# Altium project DiyOpenTx.PrjPcb
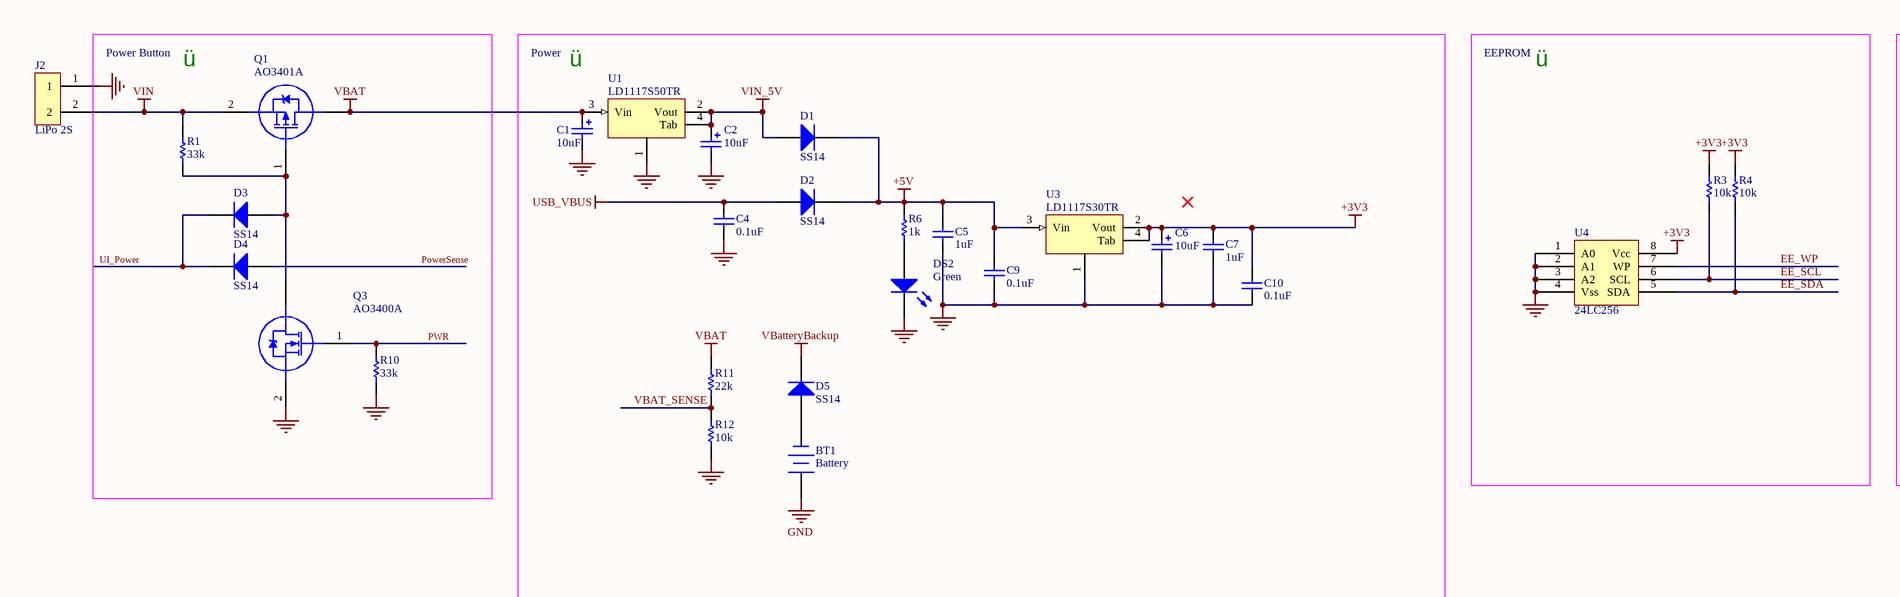
[diagram p0: DiyOpenTx.SchDoc, top left]
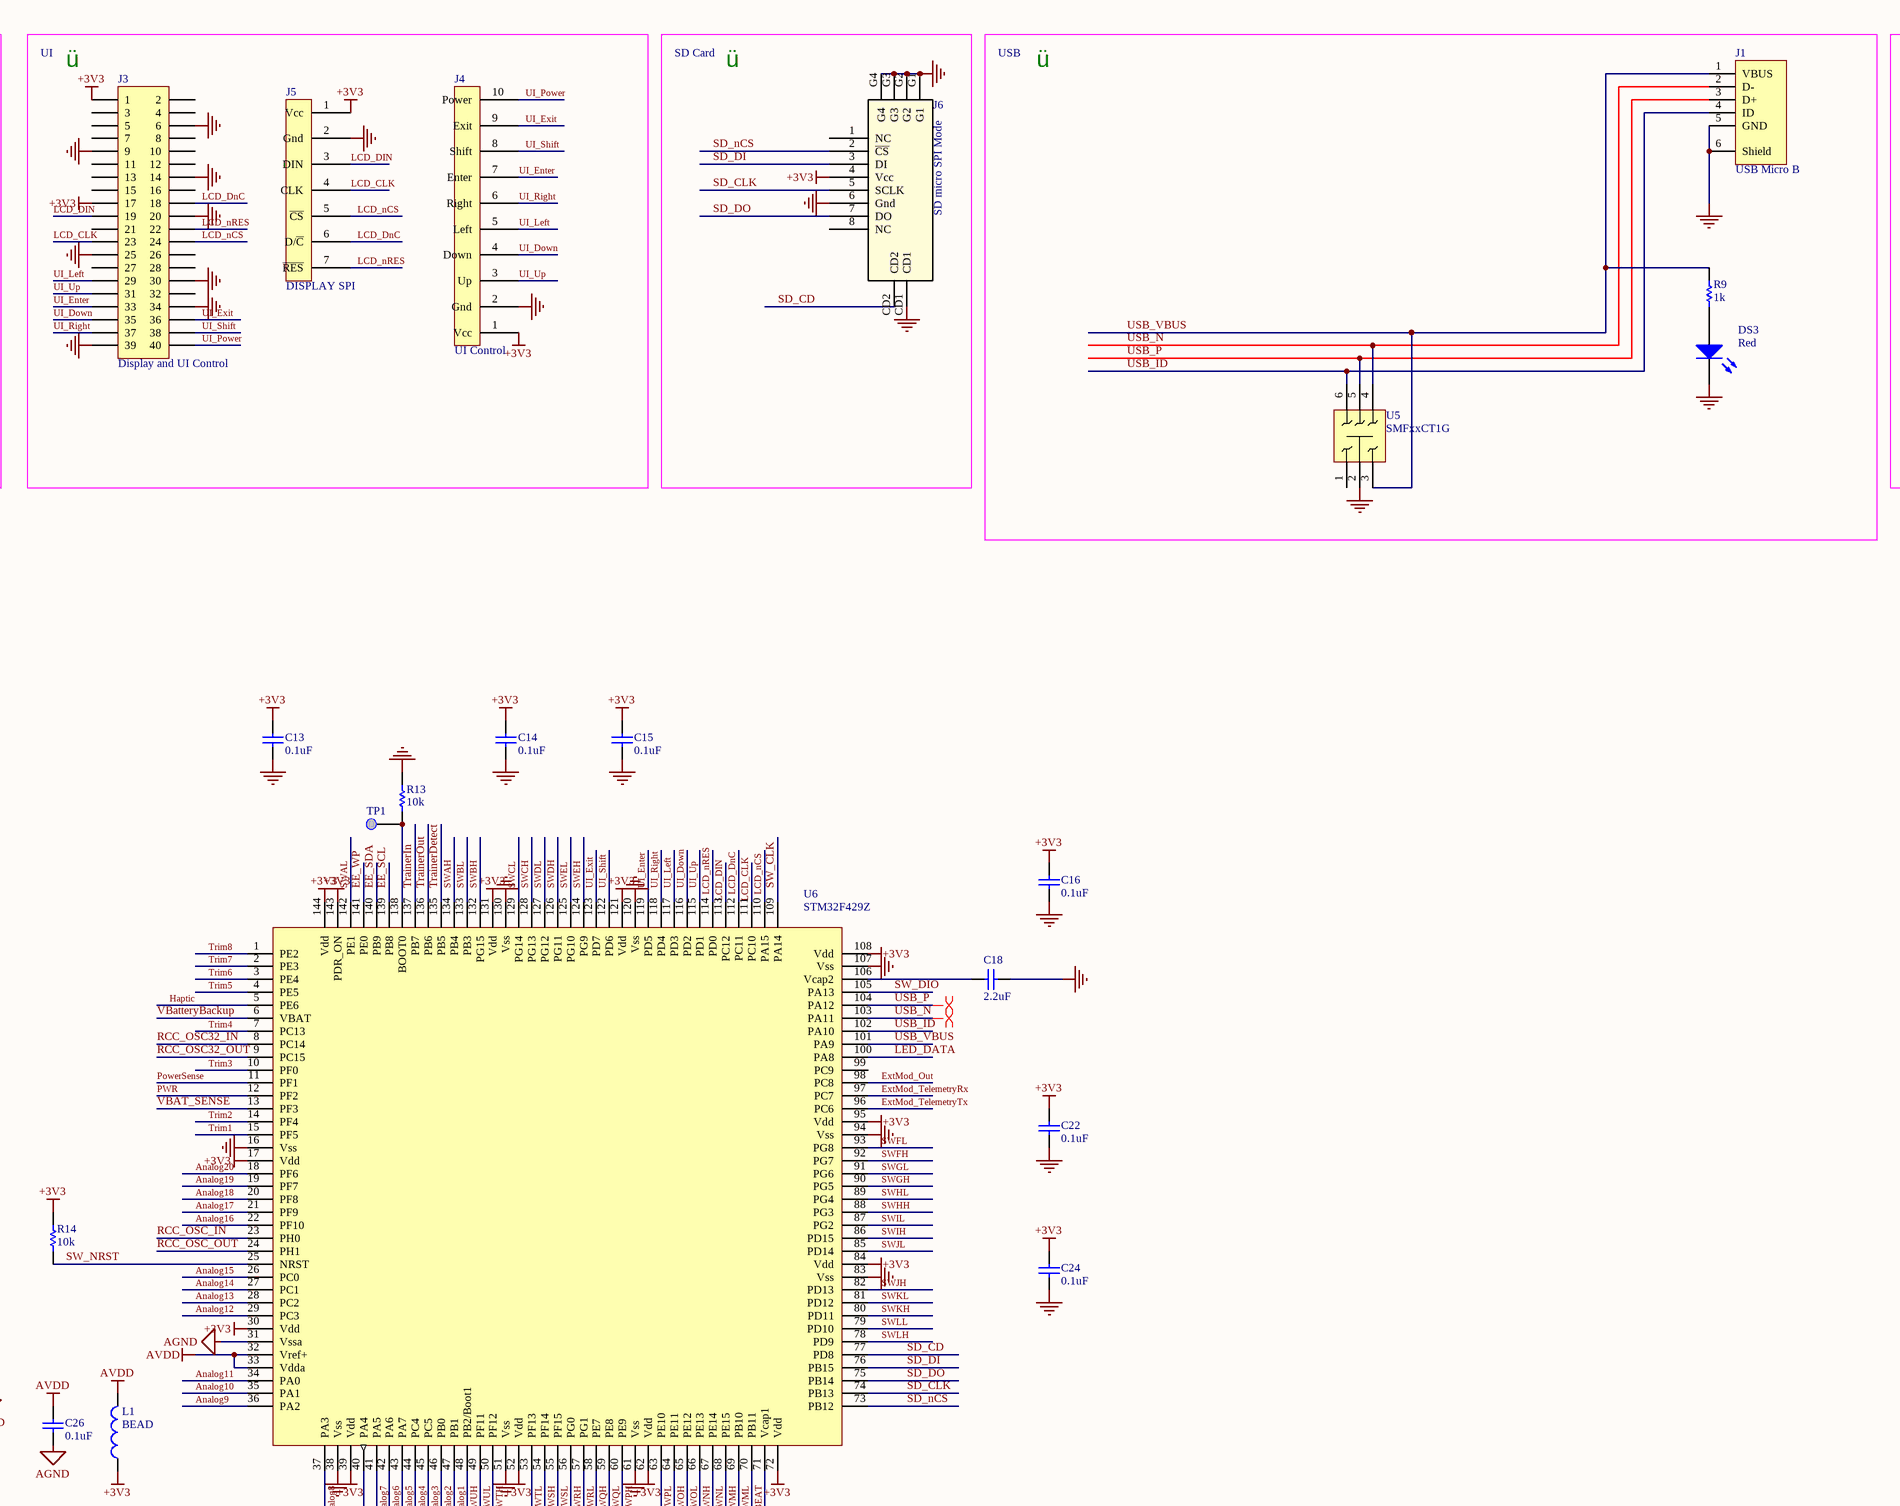
[diagram p1: DiyOpenTx.SchDoc, top middle]
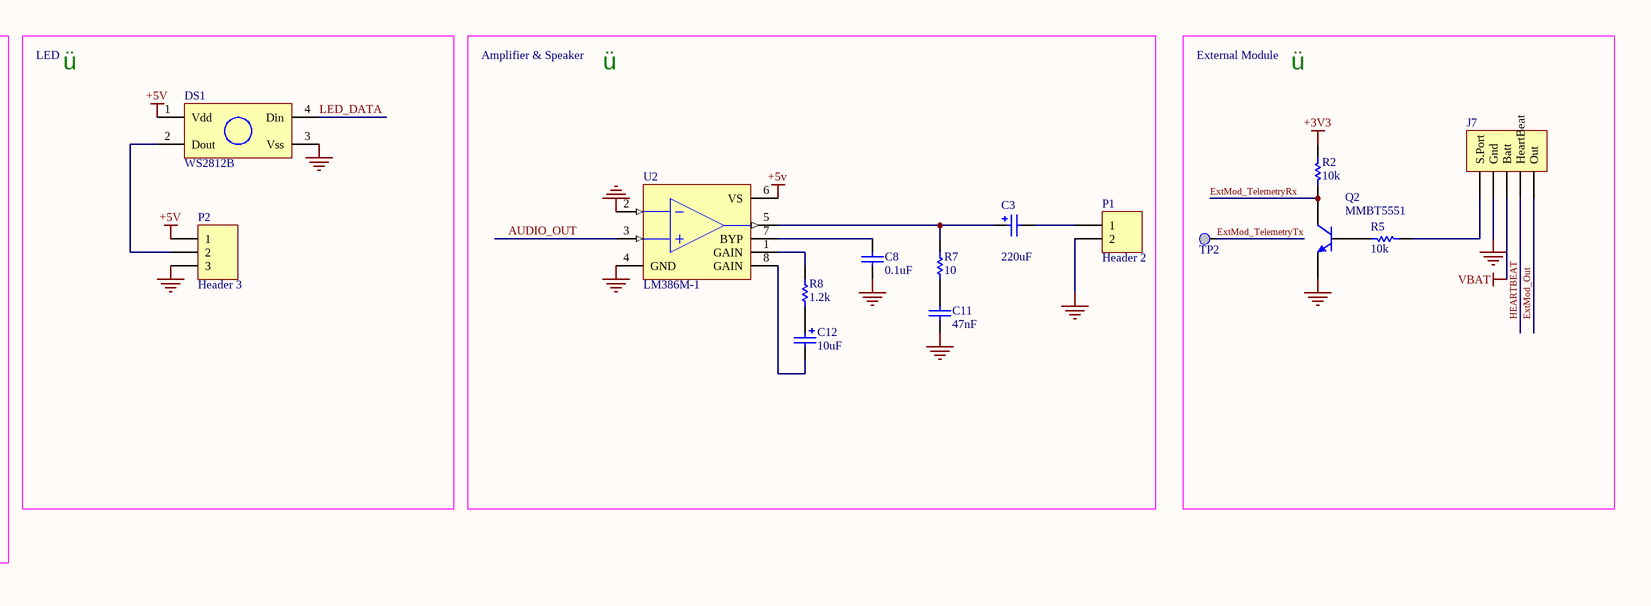
[diagram p2: DiyOpenTx.SchDoc, top right]
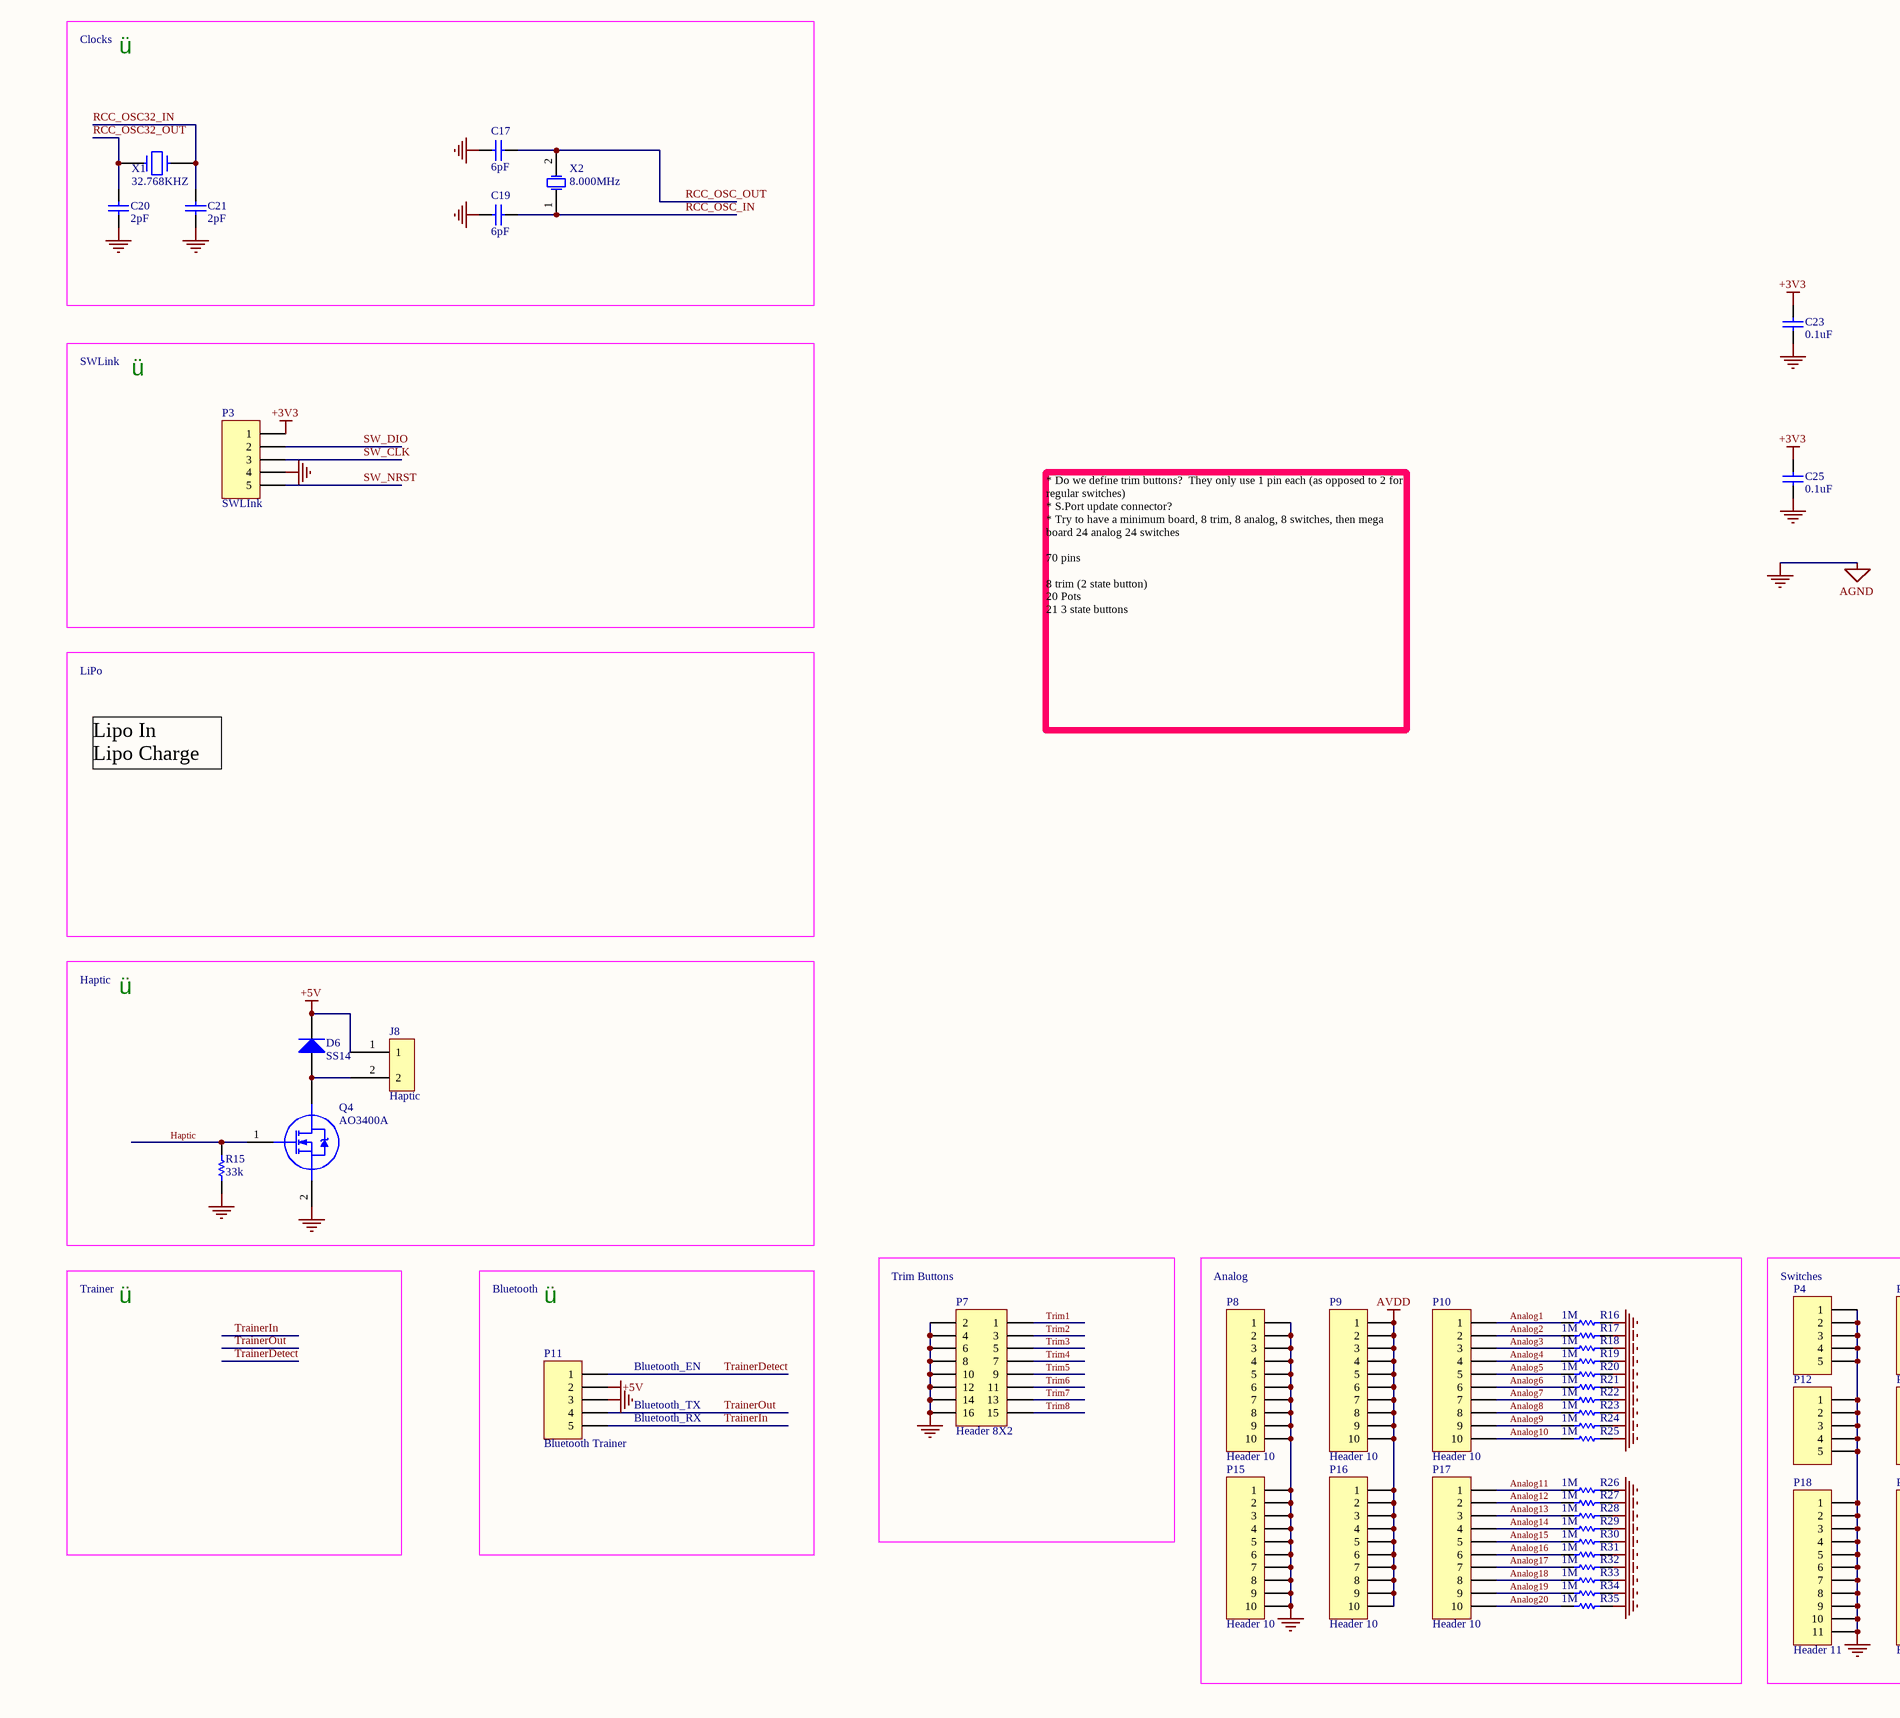
[diagram p3: DiyOpenTx.SchDoc, bottom left]
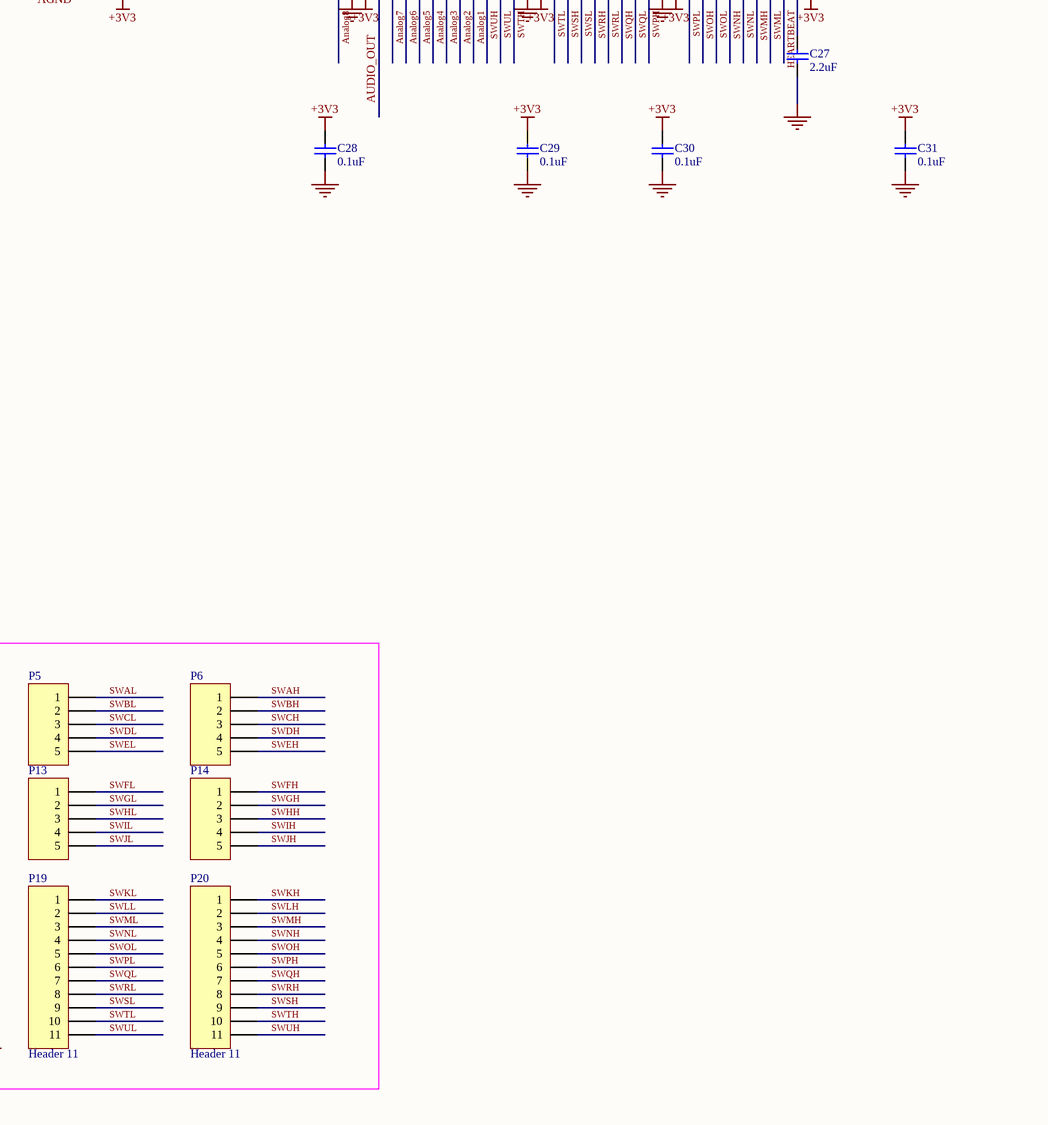
[diagram p4: DiyOpenTx.SchDoc, bottom middle]
1 sheet, 119 parts. Net scope: global (net labels, ports and power ports of the same name join across sheets).

## Sheet DiyOpenTx.SchDoc
size A0

### Parts
BT1  Battery  [Button Cell Holder 20mm SMD]
C1  10uF  [Cap SMD 1206]
C2  10uF  [Cap SMD 1206]
C3  value 220uF  [Cap SMD Elect 8x10]  (hidden comment: Cap Pol)
C4  value 0.1uF  [Cap SMD 0805A]  (hidden comment: Cap)
C5  value 1uF  [Cap SMD 0805A]  (hidden comment: Cap)
C6  10uF  [Cap SMD 1206]
C7  value 1uF  [Cap SMD 0805A]  (hidden comment: Cap)
C8  value 0.1uF  [Cap SMD 0805A]  (hidden comment: Cap)
C9  value 0.1uF  [Cap SMD 0805A]  (hidden comment: Cap)
C10  value 0.1uF  [Cap SMD 0805A]  (hidden comment: Cap)
C11  value 47nF  [Cap SMD 0805A]  (hidden comment: Cap)
C12  value 10uF  [Cap SMD 1206]  (hidden comment: Cap Pol)
C13  value 0.1uF  [Cap SMD 0805A]  (hidden comment: Cap)
C14  value 0.1uF  [Cap SMD 0805A]  (hidden comment: Cap)
C15  value 0.1uF  [Cap SMD 0805A]  (hidden comment: Cap)
C16  value 0.1uF  [Cap SMD 0805A]  (hidden comment: Cap)
C17  value 6pF  [Cap SMD 0805A]  (hidden comment: Cap)
C18  value 2.2uF  [Cap SMD 0805A]  (hidden comment: Cap)
C19  value 6pF  [Cap SMD 0805A]  (hidden comment: Cap)
C20  value 2pF  [Cap SMD 0805A]  (hidden comment: Cap)
C21  value 2pF  [Cap SMD 0805A]  (hidden comment: Cap)
C22  value 0.1uF  [Cap SMD 0805A]  (hidden comment: Cap)
C23  value 0.1uF  [Cap SMD 0805A]  (hidden comment: Cap)
C24  value 0.1uF  [Cap SMD 0805A]  (hidden comment: Cap)
C25  value 0.1uF  [Cap SMD 0805A]  (hidden comment: Cap)
C26  value 0.1uF  [Cap SMD 0805A]  (hidden comment: Cap)
C27  value 2.2uF  [Cap SMD 0805A]  (hidden comment: Cap)
C28  value 0.1uF  [Cap SMD 0805A]  (hidden comment: Cap)
C29  value 0.1uF  [Cap SMD 0805A]  (hidden comment: Cap)
C30  value 0.1uF  [Cap SMD 0805A]  (hidden comment: Cap)
C31  value 0.1uF  [Cap SMD 0805A]  (hidden comment: Cap)
D1  SS14  [DO-214AC]
D2  SS14  [DO-214AC]
D3  SS14  [DO-214AC]
D4  SS14  [DO-214AC]
D5  SS14  [DO-214AC]
D6  SS14  [DO-214AC]
DS1  WS2812B  [WS2812B 5050]
DS2  Green  [LED SMD 0805]
DS3  Red  [LED SMD 0805]
J1  USB Micro B  [USB Micro B - Molex 548190519]
J2  LiPo 2S  [0.1 SIP 2 PIN]
J3  Display and UI Control  [HDR20x2 Shrouded]
J4  UI Control  [0.1 SIP 10 PIN]
J5  DISPLAY SPI  [0.1 SIP 8 PIN]
J6  SD micro SPI Mode  [SD Card Moles 1040310811]
J7  Header 5  [HDR1X5]  (value not drawn)
J8  Haptic  [0.1 SIP 2 PIN]
L1  BEAD  [INDC1608L]
P1  Header 2  [HDR1X2]
P2  Header 3  [HDR1X3]
P3  SWLInk  [HDR1X5]
P4  Header 5  [HDR1X5]  (value not drawn)
P5  Header 5  [HDR1X5]  (value not drawn)
P6  Header 5  [HDR1X5]  (value not drawn)
P7  Header 8X2  [HDR2X8]
P8  Header 10  [HDR1X10]
P9  Header 10  [HDR1X10]
P10  Header 10  [HDR1X10]
P11  Bluetooth Trainer  [HDR1X5]
P12  Header 5  [HDR1X5]  (value not drawn)
P13  Header 5  [HDR1X5]  (value not drawn)
P14  Header 5  [HDR1X5]  (value not drawn)
P15  Header 10  [HDR1X10]
P16  Header 10  [HDR1X10]
P17  Header 10  [HDR1X10]
P18  Header 11  [HDR1X11]
P19  Header 11  [HDR1X11]
P20  Header 11  [HDR1X11]
Q1  AO3401A  [SO-G3]
Q2  MMBT5551  [SO-G3]
Q3  AO3400A  [SO-G3]
Q4  AO3400A  [SO-G3]
R1  value 33k  [Res SMD 0805A]  (hidden comment: Res1)
R2  value 10k  [Res SMD 0805A]  (hidden comment: Res1)
R3  value 10k  [Res SMD 0805A]  (hidden comment: Res1)
R4  value 10k  [Res SMD 0805A]  (hidden comment: Res1)
R5  value 10k  [Res SMD 0805A]  (hidden comment: Res1)
R6  value 1k  [Res SMD 0805A]  (hidden comment: Res1)
R7  value 10  [Res SMD 0805A]  (hidden comment: Res1)
R8  value 1.2k  [Res SMD 0805A]  (hidden comment: Res1)
R9  value 1k  [Res SMD 0805A]  (hidden comment: Res1)
R10  value 33k  [Res SMD 0805A]  (hidden comment: Res1)
R11  value 22k  [Res SMD 0805A]  (hidden comment: Res1)
R12  value 10k  [Res SMD 0805A]  (hidden comment: Res1)
R13  value 10k  [Res SMD 0805A]  (hidden comment: Res1)
R14  value 10k  [Res SMD 0805A]  (hidden comment: Res1)
R15  value 33k  [Res SMD 0805A]  (hidden comment: Res1)
R16  value 1M  [Res SMD 0805A]  (hidden comment: Res1)
R17  value 1M  [Res SMD 0805A]  (hidden comment: Res1)
R18  value 1M  [Res SMD 0805A]  (hidden comment: Res1)
R19  value 1M  [Res SMD 0805A]  (hidden comment: Res1)
R20  value 1M  [Res SMD 0805A]  (hidden comment: Res1)
R21  value 1M  [Res SMD 0805A]  (hidden comment: Res1)
R22  value 1M  [Res SMD 0805A]  (hidden comment: Res1)
R23  value 1M  [Res SMD 0805A]  (hidden comment: Res1)
R24  value 1M  [Res SMD 0805A]  (hidden comment: Res1)
R25  value 1M  [Res SMD 0805A]  (hidden comment: Res1)
R26  value 1M  [Res SMD 0805A]  (hidden comment: Res1)
R27  value 1M  [Res SMD 0805A]  (hidden comment: Res1)
R28  value 1M  [Res SMD 0805A]  (hidden comment: Res1)
R29  value 1M  [Res SMD 0805A]  (hidden comment: Res1)
R30  value 1M  [Res SMD 0805A]  (hidden comment: Res1)
R31  value 1M  [Res SMD 0805A]  (hidden comment: Res1)
R32  value 1M  [Res SMD 0805A]  (hidden comment: Res1)
R33  value 1M  [Res SMD 0805A]  (hidden comment: Res1)
R34  value 1M  [Res SMD 0805A]  (hidden comment: Res1)
R35  value 1M  [Res SMD 0805A]  (hidden comment: Res1)
TP1  Test Point  [TestPoint through hole small]  (value not drawn)
TP2  Test Point  [TestPoint through hole small]  (value not drawn)
U1  LD1117S50TR  [SOT-223]
U2  LM386M-1  [M08A_N]
U3  LD1117S30TR  [SOT-223]
U4  24LC256  [SOIC8]
U5  SMFxxCT1G  [SOT-363]
U6  STM32F429Z  [LQFP144]
X1  32.768KHZ  [Crystal SMD-3215_2P]
X2  8.000MHz  [Crystal SMD-5032_2P]

### Blocks framed on the sheet
ü: D3 D4 Q1 Q3 R1 R10
ü: BT1 C1 C2 C4-C7 C9 C10 D1 D2 D5 DS2 R6 R11 R12 U1 U3
ü: R3 R4 U4
ü: J3-J5
ü: J6
ü: DS3 J1 R9 U5
ü: DS1 P2
ü: C3 C8 C11 C12 P1 R7 R8 U2
ü: J7 Q2 R2 R5 TP2
ü: C17 C19-C21 X1 X2
ü: P3
ü: D6 J8 Q4 R15
ü: P11
Trim Buttons: P7
Analog: P8-P10 P15-P17 R16-R35
Switches: P4-P6 P12-P14 P18-P20

### Nets
+3V3: C6.1 C7.2 C10.2 C13.2 C14.2 C15.2 C16.2 C22.2 C23.2 C24.2 C25.2 C28.2 C29.2 C30.2 C31.2 J3.1 J3.17 J4.1(Vcc) J5.1(Vcc) J6.4(Vcc) L1.1 P3.1 R2.1 R3.1 R4.1 R14.2 U3.2(Vout) U3.4(Tab) U4.8(Vcc) U6.17(Vdd) U6.30(Vdd) U6.39(Vdd) U6.52(Vdd) U6.62(Vdd) U6.72(Vdd) U6.84(Vdd) U6.95(Vdd) U6.108(Vdd) U6.121(Vdd) U6.131(Vdd) U6.143(PDR_ON) U6.144(Vdd)
+5V: C5.2 C9.2 D1.2(K) D2.2(K) D6.2(K) DS1.1(Vdd) J8.1 P2.1 P11.2 R6.2 U2.6(VS) U3.3(Vin)
AGND: BT1.1(+) C1.2 C2.2 C4.1 C5.1 C6.2 C7.1 C8.2 C9.1 C10.1 C11.2 C13.1 C14.1 C15.1 C16.1 C17.1 C18.2 C19.1 C20.2 C21.2 C22.1 C23.1 C24.1 C25.1 C26.1 C27.1 C28.1 C29.1 C30.1 C31.1 DS1.3(Vss) DS2.K DS3.K J1.5(GND) J1.6(Shield) J2.1 J3.6 J3.9 J3.14 J3.20 J3.25 J3.30 J3.34 J3.39 J4.2(Gnd) J5.2(Gnd) J6.6(Gnd) J6.CD1 J6.G1 J6.G2 J6.G3 J6.G4 J7.4(Gnd) P1.2 P2.3 P3.4 P4.1 P4.2 P4.3 P4.4 P4.5 P7.2 P7.4 P7.6 P7.8 P7.10 P7.12 P7.14 P7.16 P8.1 P8.2 P8.3 P8.4 P8.5 P8.6 P8.7 P8.8 P8.9 P8.10 P11.3 P12.1 P12.2 P12.3 P12.4 P12.5 P15.1 P15.2 P15.3 P15.4 P15.5 P15.6 P15.7 P15.8 P15.9 P15.10 P18.1 P18.2 P18.3 P18.4 P18.5 P18.6 P18.7 P18.8 P18.9 P18.10 P18.11 Q2.E Q3.2(S) Q4.2(S) R10.2 R12.2 R13.2 R15.2 R16.1 R17.1 R18.1 R19.1 R20.1 R21.1 R22.1 R23.1 R24.1 R25.1 R26.1 R27.1 R28.1 R29.1 R30.1 R31.1 R32.1 R33.1 R34.1 R35.1 U1.1 U2.2(IN-) U2.4(GND) U3.1 U4.1(A0) U4.2(A1) U4.3(A2) U4.4(Vss) U5.2 U6.16(Vss) U6.31(Vssa) U6.38(Vss) U6.51(Vss) U6.61(Vss) U6.83(Vss) U6.94(Vss) U6.107(Vss) U6.120(Vss) U6.130(Vss)  [also labelled GND]
AVDD: C26.2 L1.2 P9.1 P9.2 P9.3 P9.4 P9.5 P9.6 P9.7 P9.8 P9.9 P9.10 P16.1 P16.2 P16.3 P16.4 P16.5 P16.6 P16.7 P16.8 P16.9 P16.10 U6.32(Vref+) U6.33(Vdda)
USB_VBUS: C4.2 D2.1(A) J1.1(VBUS) R9.1 U5.3 U6.101(PA9)
VBAT: C1.1 J7.3(Batt) Q1.3(D) R11.1 U1.3(Vin)
VBatteryBackup: D5.2(K) U6.6(VBAT)
VIN: J2.2 Q1.2(S) R1.1
VIN_5V: C2.1 D1.1(A) U1.2(Vout) U1.4(Tab)
Analog1: P10.1 R16.2 U6.47(PB1)
Analog2: P10.2 R17.2 U6.46(PB0)
Analog3: P10.3 R18.2 U6.45(PC5)
Analog4: P10.4 R19.2 U6.44(PC4)
Analog5: P10.5 R20.2 U6.43(PA7)
Analog6: P10.6 R21.2 U6.42(PA6)
Analog7: P10.7 R22.2 U6.41(PA5)
Analog8: P10.8 R23.2 U6.37(PA3)
Analog9: P10.9 R24.2 U6.36(PA2)
Analog10: P10.10 R25.2 U6.35(PA1)
Analog11: P17.1 R26.2 U6.34(PA0)
Analog12: P17.2 R27.2 U6.29(PC3)
Analog13: P17.3 R28.2 U6.28(PC2)
Analog14: P17.4 R29.2 U6.27(PC1)
Analog15: P17.5 R30.2 U6.26(PC0)
Analog16: P17.6 R31.2 U6.22(PF10)
Analog17: P17.7 R32.2 U6.21(PF9)
Analog18: P17.8 R33.2 U6.20(PF8)
Analog19: P17.9 R34.2 U6.19(PF7)
Analog20: P17.10 R35.2 U6.18(PF6)
AUDIO_OUT: U2.3(IN+) U6.40(PA4)
EE_SCL: R3.2 U4.6(SCL) U6.139(PB8)
EE_SDA: R4.2 U4.5(SDA) U6.140(PB9)
EE_WP: U4.7(WP) U6.141(PE0)
ExtMod_Out: J7.1(Out) U6.98(PC8)
ExtMod_TelemetryRx: Q2.C R2.2 U6.97(PC7)
ExtMod_TelemetryTx: TP2.1 U6.96(PC6)
Haptic: Q4.1(G) R15.1 U6.5(PE6)
HEARTBEAT: J7.2(HeartBeat) U6.70(PB11)
LCD_CLK: J3.23 J5.4(CLK) U6.111(PC10)
LCD_DIN: J3.19 J5.3(DIN) U6.113(PC12)
LCD_DnC: J3.18 J5.6(D/~{C}) U6.112(PC11)
LCD_nCS: J3.24 J5.5(~{CS}) U6.110(PA15)
LCD_nRES: J3.22 J5.7(~{RES}) U6.114(PD0)
LED_DATA: DS1.4(Din) U6.100(PA8)
PowerSense: D4.1(A) U6.11(PF1)
PWR: Q3.1(G) R10.1 U6.12(PF2)
RCC_OSC32_IN: C21.1 U6.8(PC14) X1.2
RCC_OSC32_OUT: C20.1 U6.9(PC15) X1.1
RCC_OSC_IN: C19.2 U6.23(PH0) X2.1(OSC1)
RCC_OSC_OUT: C17.2 U6.24(PH1) X2.2(OSC2)
SD_CD: J6.CD2 U6.77(PD8)
SD_CLK: J6.5(SCLK) U6.74(PB13)
SD_DI: J6.3(DI) U6.76(PB15)
SD_DO: J6.7(DO) U6.75(PB14)
SD_nCS: J6.2(~{CS}) U6.73(PB12)
SW_CLK: P3.3 U6.109(PA14)
SW_DIO: P3.2 U6.105(PA13)
SW_NRST: P3.5 R14.1 U6.25(NRST)
SWAH: P6.1 U6.134(PB4)
SWAL: P5.1 U6.142(PE1)
SWBH: P6.2 U6.132(PG15)
SWBL: P5.2 U6.133(PB3)
SWCH: P6.3 U6.128(PG13)
SWCL: P5.3 U6.129(PG14)
SWDH: P6.4 U6.126(PG11)
SWDL: P5.4 U6.127(PG12)
SWEH: P6.5 U6.124(PG9)
SWEL: P5.5 U6.125(PG10)
SWFH: P14.1 U6.92(PG7)
SWFL: P13.1 U6.93(PG8)
SWGH: P14.2 U6.90(PG5)
SWGL: P13.2 U6.91(PG6)
SWHH: P14.3 U6.88(PG3)
SWHL: P13.3 U6.89(PG4)
SWIH: P14.4 U6.86(PD15)
SWIL: P13.4 U6.87(PG2)
SWJH: P14.5 U6.82(PD13)
SWJL: P13.5 U6.85(PD14)
SWKH: P20.1 U6.80(PD11)
SWKL: P19.1 U6.81(PD12)
SWLH: P20.2 U6.78(PD9)
SWLL: P19.2 U6.79(PD10)
SWMH: P20.3 U6.68(PE15)
SWML: P19.3 U6.69(PB10)
SWNH: P20.4 U6.66(PE13)
SWNL: P19.4 U6.67(PE14)
SWOH: P20.5 U6.64(PE11)
SWOL: P19.5 U6.65(PE12)
SWPH: P20.6 U6.60(PE9)
SWPL: P19.6 U6.63(PE10)
SWQH: P20.7 U6.58(PE7)
SWQL: P19.7 U6.59(PE8)
SWRH: P20.8 U6.56(PG0)
SWRL: P19.8 U6.57(PG1)
SWSH: P20.9 U6.54(PF14)
SWSL: P19.9 U6.55(PF15)
SWTH: P20.10 U6.50(PF12)
SWTL: P19.10 U6.53(PF13)
SWUH: P20.11 U6.48(PB2/Boot1)
SWUL: P19.11 U6.49(PF11)
TrainerDetect: P11.1 U6.135(PB5)
TrainerIn: P11.5 U6.137(PB7)
TrainerOut: P11.4 U6.136(PB6)
Trim1: P7.1 U6.15(PF5)
Trim2: P7.3 U6.14(PF4)
Trim3: P7.5 U6.10(PF0)
Trim4: P7.7 U6.7(PC13)
Trim5: P7.9 U6.4(PE5)
Trim6: P7.11 U6.3(PE4)
Trim7: P7.13 U6.2(PE3)
Trim8: P7.15 U6.1(PE2)
UI_Down: J3.35 J4.4(Down) U6.116(PD2)
UI_Enter: J3.33 J4.7(Enter) U6.119(PD5)
UI_Exit: J3.36 J4.9(Exit) U6.123(PD7)
UI_Left: J3.29 J4.5(Left) U6.117(PD3)
UI_Power: D3.2(K) D4.2(K) J3.40 J4.10(Power)
UI_Right: J3.37 J4.6(Right) U6.118(PD4)
UI_Shift: J3.38 J4.8(Shift) U6.122(PD6)
UI_Up: J3.31 J4.3(Up) U6.115(PD1)
USB_ID: J1.4(ID) U5.6 U6.102(PA10)
USB_N: J1.2(D-) U5.4 U6.103(PA11)
USB_P: J1.3(D+) U5.5 U6.104(PA12)
VBAT_SENSE: R11.2 R12.1 U6.13(PF3)
NetBT1_2: BT1.2(-) D5.1(A)
NetC3_1: C3.1 R7.2 U2.5(OUT)
NetC3_2: C3.2 P1.1
NetC8_1: C8.1 U2.7(BYP)
NetC11_1: C11.1 R7.1
NetC12_1: C12.1 R8.1
NetC12_2: C12.2 U2.8(GAIN)
NetC18_1: C18.1 U6.106(Vcap2)
NetC27_2: C27.2 U6.71(Vcap1)
NetD3_1: D3.1(A) Q1.1(G) Q3.3(D) R1.2
NetD6_1: D6.1(A) J8.2 Q4.3(D)
NetDS1_2: DS1.2(Dout) P2.2
NetDS2_A: DS2.A R6.1
NetDS3_A: DS3.A R9.2
NetJ7_5: J7.5(S.Port) R5.1
NetQ2_B: Q2.B R5.2
NetR8_2: R8.2 U2.1(GAIN)
NetR13_1: R13.1 TP1.1 U6.138(BOOT0)

Not connected (* = marked no-connect by the designer): J3 2 3 4 5 7 8 10 11 12 13 15 16 21 26 27 28 32; J6 1(NC) 8(NC); U5 1; U6 99(PC9)

### Layout directives
differential pair: USB_N, USB_P

### Notes on the sheet
- Power Button
- Power
- EEPROM
- UI
- SD Card
- USB
- LED
- Amplifier & Speaker
- External Module
- Clocks
- SWLink
- LiPo
- * Do we define trim buttons?  They only use 1 pin each (as opposed to 2 for regular switches)
  * S.Port update connector?
  * Try to have a minimum board, 8 trim, 8 analog, 8 switches, then mega board 24 analog 24 switches
  70 pins
  8 trim (2 state button)
  20 Pots
  21 3 state buttons
- Lipo In
  Lipo Charge
- Haptic
- Trainer
- ü
- Bluetooth
- Bluetooth_EN
- Bluetooth_TX
- Bluetooth_RX

### Library data of the parts
BT1 = Battery: Multicell Battery; Published: 24-Mar-1999; LatestRevisionDate: 17-Jul-2002; LatestRevisionNote: Re-released for DXP Platform.; PackageReference: BAT-2; Publisher: Altium Limited; PackageDescription: Battery; 2 Leads
C1 C2 C6 = Cap Pol1: Polarized Capacitor (Radial); Published: 8-Jun-2000; Revision: July-2002: Re-released for DXP Platform.; Publisher: Altium Limited; Value: 10uF; LCSC: C7171; Package: CASE-A_3216
C3 C12 = Cap Pol: Polarized Capacitor (Radial); Published: 8-Jun-2000; LatestRevisionDate: 17-Jul-2002; LatestRevisionNote: Re-released for DXP Platform.; PackageReference: RB7.6-15; Publisher: Altium Limited; PackageDescription: Polarized Capacitor (Radial); 2 Leads
  C3: LCSC: C134765; Package: SMD-ECAP-8x10
  C12: LCSC: C7171; Package: CASE-A_3216
C4 C5 C7-C11 C13-C31 = Cap: Capacitor; Published: 8-Jun-2000; LatestRevisionDate: 17-Jul-2002; LatestRevisionNote: Re-released for DXP Platform.; PackageReference: RAD-0.3; Publisher: Altium Limited; PackageDescription: Radial Cap, Thru-Hole; 2 Leads; 0.3 in Pin Spacing; Package: 0805
  C4 C8-C10 C13-C16 C22-C26 C28-C31: LCSC: C49678
  C5 C7: LCSC: C28323
  C11: LCSC: C53134
  C17 C19: LCSC: C67560
  C18 C27: LCSC: C49217
  C20 C21: LCSC: C1800
D1-D6 = Diode: Default Diode; pin to pad: 1>2 2>1; Code - JEDEC: DO-214-AB; Ordered by: STM; ECCN_US/EU: EAR99/NEC; Published: 8-Jun-2000; Revision: July-2002: Re-released for DXP Platform.; Publisher: Altium Limited; LCSC: C2480; Package: SMA,DO-214AC
DS1 = WS2812B: WS2812B Intelligent LED; LCSC: C114586; Package: LED_4-5050
DS2 DS3 = LED: RGB LED Common Anode; Published: 8-Jun-2000; Revision: July-2002: Re-released for DXP Platform.; Publisher: Altium Limited; Package: LED_0805
  DS2: LCSC: C2297
  DS3: LCSC: C84256
J1 = USB Micro B: pin to pad: 6>Shield
J2 J8 = SIP2 CONNECTOR
J3 = Header 20X2: Header, 20-Pin, Dual row; LatestRevisionDate: 17-Jul-2002; LatestRevisionNote: Re-released for DXP Platform.; Publisher: Altium Limited
J4 = SIP10 CONNECTOR
J5 = SIP7 CONNECTOR
J6 = SD micro w/ CD
J7 P3-P6 P11-P14 = Header 5: Header, 5-Pin; LatestRevisionDate: 17-Jul-2002; LatestRevisionNote: Re-released for DXP Platform.; Publisher: Altium Limited
L1 = Inductor: Code_IEC: 1005; Value: 10mH; Published: 8-Jun-2000; LatestRevisionDate: 29-May-2009; LatestRevisionNote: IPC-7351 Footprint Added.; PackageReference: 0402-A; Publisher: Altium Limited; PackageDescription: Chip Inductor; Code_JEITA: 0402; LCSC: C1017; Package: 0805
P1 = Header 2: Header, 2-Pin; LatestRevisionDate: 17-Jul-2002; LatestRevisionNote: Re-released for DXP Platform.; Publisher: Altium Limited
P2 = Header 3: Header, 3-Pin; LatestRevisionDate: 17-Jul-2002; LatestRevisionNote: Re-released for DXP Platform.; Publisher: Altium Limited
P7 = Header 8X2: Header, 8-Pin, Dual row; LatestRevisionDate: 17-Jul-2002; LatestRevisionNote: Re-released for DXP Platform.; Publisher: Altium Limited
P8-P10 P15-P17 = Header 10: Header, 10-Pin; LatestRevisionDate: 17-Jul-2002; LatestRevisionNote: Re-released for DXP Platform.; Publisher: Altium Limited
P18-P20 = Header 11: Header, 11-Pin; LatestRevisionDate: 17-Jul-2002; LatestRevisionNote: Re-released for DXP Platform.; Publisher: Altium Limited
Q1 = NTR4101P: HEXFET Power MOSFET; Revision 1: 29-Sep-2000: Re-orientated a 'Drain' pin on first part.; Revision 2: 17-Jul-2002: Re-released for DXP Platform.; Package Information: Latest Revision: Feb-2001; Code - JEDEC: MS-012-AA; Published: 8-Jun-2000; Datasheet: Latest Revision: Dec-1997; Package Reference: SO-8; Publisher: Altium Limited; LCSC: C15127; Package: SOT-23-3L
Q2 = MMBT100A: General Purpose Amplifier NPN Silicon; pin to pad: B>1 C>3 E>2; Package Information: Latest Revision: 1997; Published: 29-Sep-2000; Revision: 17-Jul-2002: Re-released for DXP Platform.; Datasheet: Latest Revision: 1996; Package Reference: 318-08; Publisher: Altium Limited; LCSC: C2145; Package: SOT-23-3
Q3 Q4 = NTR4501N: HEXFET Power MOSFET; Revision 1: 29-Sep-2000: Re-orientated a 'Drain' pin on first part.; Revision 2: 17-Jul-2002: Re-released for DXP Platform.; Package Information: Latest Revision: Feb-2001; Code - JEDEC: MS-012-AA; Published: 8-Jun-2000; Datasheet: Latest Revision: Dec-1997; Package Reference: SO-8; Publisher: Altium Limited; LCSC: C347475; Package: SOT-23-3
R1-R35 = Resistor: Package: 0805
  R1 R10 R15: LCSC: C17621
  R2 R5 R12-R14: LCSC: C17414
  R3 R4: LCSC: C17673
  R6 R9: LCSC: C17513
  R7: LCSC: C17415
  R8: LCSC: C17379
  R11: LCSC: C17560
  R16-R35: LCSC: C17514
TP1 TP2 = TestPoint
U1 U3 = LD1117: pin to pad: 4>2; Package: SOT-223
  U1: LCSC: C6187
  U3: LCSC: C6186
U2 = LM386M-1: Low-Voltage Audio Power Amplifier; Published: 15-Apr-2002; LatestRevisionDate: 13-Apr-2006; LatestRevisionNote: IPC-7351 Footprint Added.; DatasheetVersion: Sep-1997; PackageVersion: Sep-1997; PackageReference: M08A; Publisher: Altium Limited; PackageDescription: 8-Pin Small Outline Integrated Circuit 1.27 mm Pitch; Code_JEDEC: MS-012-AA; Code_IPC: SOIC127P600-8; ComponentLink1Description: Manufacturer Link; ComponentLink1URL: http://www.national.com/; ComponentLink2Description: Datasheet; ComponentLink2URL: http://www.national.com/ds.cgi/LM/LM386.pdf; ComponentLink3Description: URL Link1; ComponentLink3URL: http://www.national.com/pf/LM/LM386.html; LCSC: C23573; Package: SOIC-8_3.9x4.9x1.27P
U5 = SMFxxCT1G 5 Line TVS Array: LCSC: C15879; Package: SOT-363
U6 = STM32F429Zxx: LCSC: C46525; Package: LQFP-144_20.0x20.0x0.5P
X1 = CRYSTAL_32K: Crystal; LCSC: C32346; Package: SMD-3215_2P
X2 = XTAL: Crystal Oscillator; Published: 8-Jun-2000; LatestRevisionDate: 17-Jul-2002; LatestRevisionNote: Re-released for DXP Platform.; PackageReference: R38; Publisher: Altium Limited; LCSC: C115962; Package: SMD-5032_2P
U4 = 24LC256: LCSC: C6482; Package: SOIC-8_3.9x4.9x1.27P